# EasyEDA Pro project AudioPower.epro

# Schematic Schematic3
Board Name: Board3; Create Date: 2024-12-13; Page Name: P1; Project Name: kpi2024_0; Schematic Name: Schematic3; Update Date: 2024-12-13; Company: EasyEDA.com; Page Size: A4; Version: V1.0
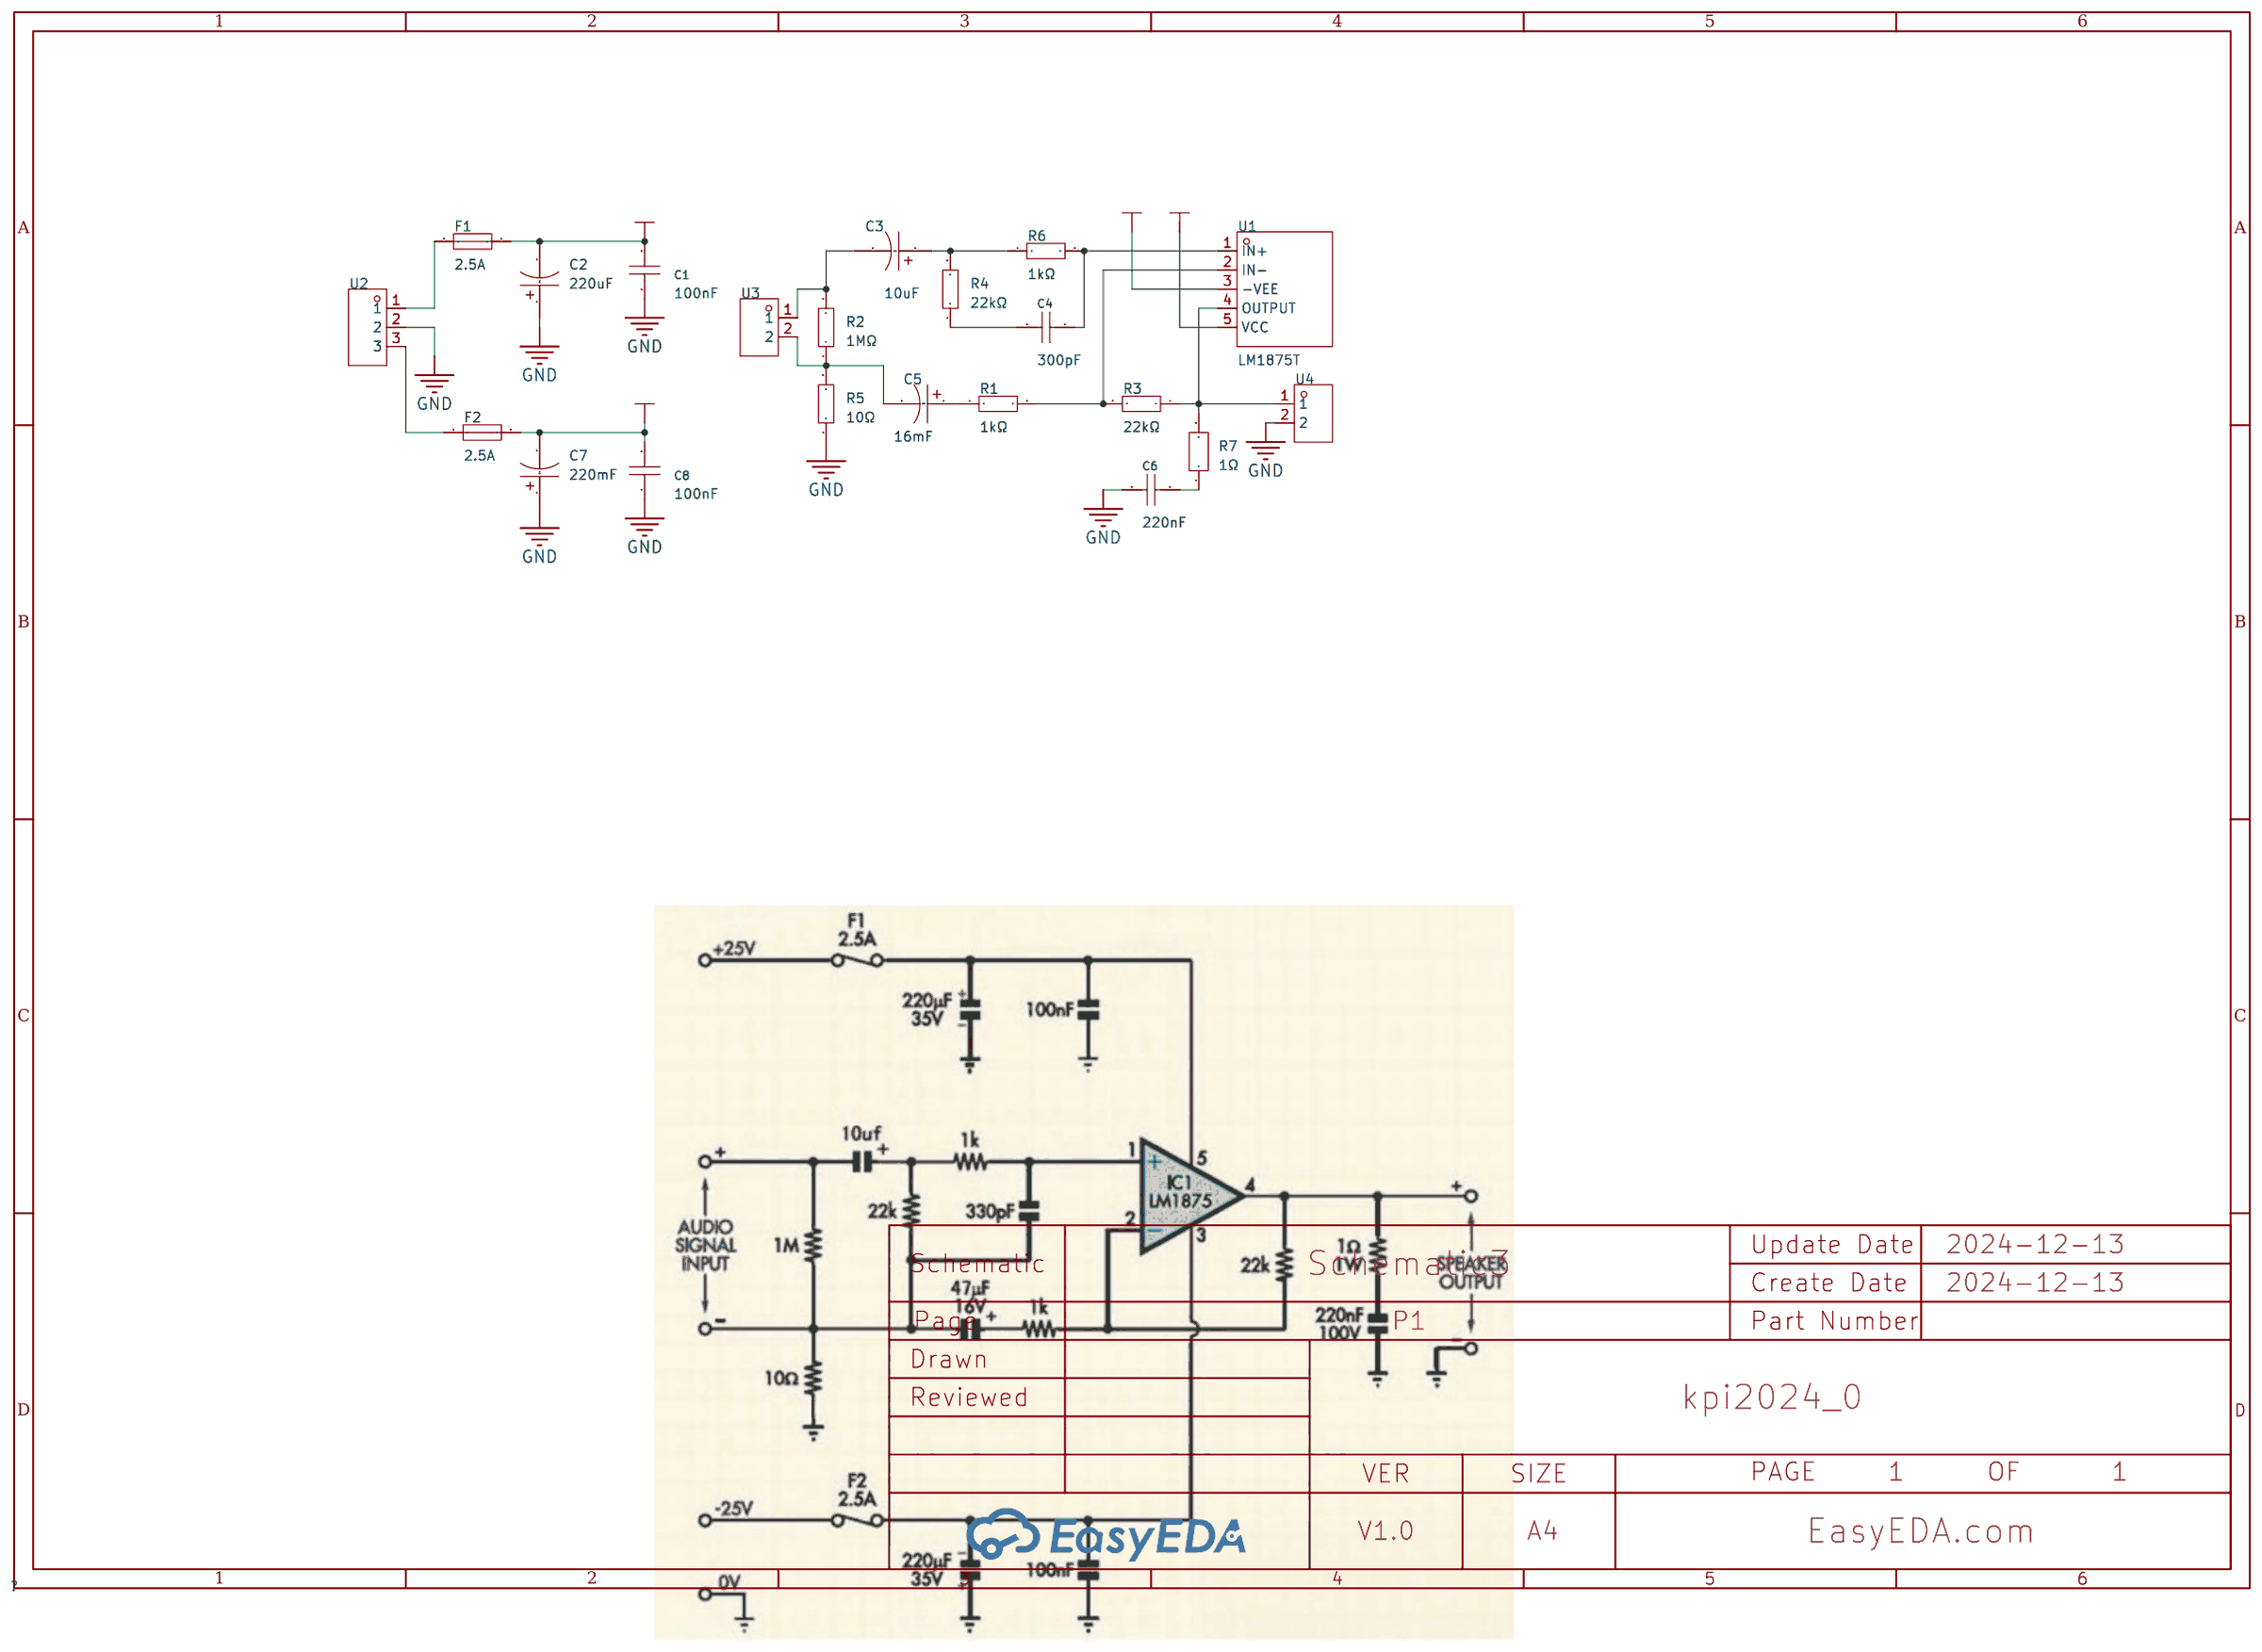
[diagram p0: schematic sheet]

## Parts
C1  100nF  [C0603]
C2  220uF  [CAP-SMD_L7.3-W4.3-FD]
C3  10uF  [CAP-SMD_L7.3-W4.3-FD]
C4  300pF  [C0603]
C5  16mF  [CAP-SMD_L7.3-W4.3-FD]
C6  220nF  [C0603]
C7  220mF  [CAP-SMD_L7.3-W4.3-FD]
C8  100nF  [C0603]
F1  2.5A  [F0603]
F2  2.5A  [F0603]
R1  1kΩ  [R0603]
R2  1МΩ  [R0603]
R3  22kΩ  [R0603]
R4  22kΩ  [R0603]
R5  10Ω  [R0603]
R6  1kΩ  [R0603]
R7  1Ω  [RES-TH_BD4.5-L11.0-P15.00-D0.7]
U1  LM1875T  [TO-220-5_L10.2-W4.8-P1.70-TL]
U2  DB910-6.35-3P-GN-P  [CONN-TH_3P-P6.35_DB910-6.35-3P-GN-P]
U3  TY500-5.0-02P-14-00AH  [CONN-TH_2P-P5.00_TOPONELEC_TY500-5.0-02P-14-00AH]
U4  TY500-5.0-02P-14-00AH  [CONN-TH_2P-P5.00_TOPONELEC_TY500-5.0-02P-14-00AH]

## Library data of the parts
C1 C4 C6 C8 = 0603B104K500NT_C30926: Capacitance:100nF Tolerance:±10% Tolerance:±10% Voltage Rated: Temperature Coefficient:; LCSC Part Name: 100nF ±10% 50V; Supplier Part: C30926; Manufacturer: FH(风华); Manufacturer Part: 0603B104K500NT; Supplier Footprint: 0603; JLCPCB Part Class: Extended Part; Datasheet: https://atta.szlcsc.com/upload/public/pdf/source/20200305/C486355_26A10D38EF8C2A5C37091D0039909270.pdf; Supplier: LCSC; Tolerance: ±10%
C2 C3 C5 C7 = 6TPF220MFL: Capacitance: Tolerance:±20% Tolerance:±20% Rated Voltage: Operating Temperature:-55℃~+105℃ Operating Temperature:-55℃~+105℃; LCSC Part Name: 220uF ±20% 6.3V; Supplier Part: C2972205; Manufacturer: PANASONIC(松下); JLCPCB Part Class: Extended Part; Datasheet: https://atta.szlcsc.com/upload/public/pdf/source/20220222/01A4DB965CB56D0C2F7295D2904BDB39.pdf; Supplier: LCSC; Tolerance: ±20%; Operating Temperature: -55℃~+105℃
F1 F2 = R06.000.2.5: Type:SMD Fuse Current Rating:2.5A; LCSC Part Name: 2.5A 63V; Supplier Part: C2874850; Manufacturer: Reomax(瑞迈); Supplier Footprint: 0603; JLCPCB Part Class: Extended Part; Datasheet: https://atta.szlcsc.com/upload/public/pdf/source/20210813/DD43B9BBE2E14D9CDA0B5C9047EE88A2.pdf; Supplier: LCSC; Type: SMD Fuse
R1-R6 = 0603WAF1001T5E: Type:Thick Film Resistors Resistance:1kΩ Tolerance:±1% Tolerance:±1% Power(Watts): Overload Voltage (Max): Temperature Coefficient:±100ppm/℃ Temperature Coefficient:±100ppm/℃ Operating Temperature Range:-55℃~+155℃ Operating Temperature Range:-55℃~+155℃; LCSC Part Name: 1kΩ ±1% 100mW 厚膜电阻; Supplier Part: C21190; Manufacturer: UNI-ROYAL(厚声); Supplier Footprint: 0603; JLCPCB Part Class: Basic Part; Datasheet: https://atta.szlcsc.com/upload/public/pdf/source/20200306/C422600_1E6D84923E4A46A82E41ADD87F860B5C.pdf; Supplier: LCSC; Type: Thick Film Resistors; Tolerance: ±1%; Temperature Coefficient: ±100ppm/℃; Operating Temperature Range: -55℃~+155℃
R7 = RN 1W 13R F T/B A1: Type:Metal Film Resistors Resistance: Tolerance:±1% Tolerance:±1% Overload Voltage (Max):500V Power(Watts):1W Temperature Coefficient:±50ppm/℃ Temperature Coefficient:±50ppm/℃ Operating Temperature Range:-55℃~+125℃ Operating Temperature Range:-55℃~+125℃; LCSC Part Name: 13Ω ±1% 1W 金属膜电阻; Supplier Part: C433630; Manufacturer: Tyohm(幸亚电阻); Supplier Footprint: 插件,D4.5xL11mm; JLCPCB Part Class: Extended Part; Datasheet: https://atta.szlcsc.com/upload/public/pdf/source/20191008/C433681_B72693A7FD256E0D1DC5EFE3F095EED3.pdf; Supplier: LCSC; Type: Metal Film Resistors; Tolerance: ±1%; Overload Voltage (Max): 500V; Power(Watts): 1W; Temperature Coefficient: ±50ppm/℃; Operating Temperature Range: -55℃~+125℃
U1 = LM1875T: Type of Power Amplifier: Speaker Channels:Monaural Output Power: Supply Voltage:16V~60V；8V~30V Supply Voltage:16V~60V；8V~30V Operating Temperature:0℃~+70℃ Operating Temperature:0℃~+70℃; Supplier Part: C2862102; Manufacturer: TI(德州仪器); Supplier Footprint: TO-220-5; JLCPCB Part Class: Extended Part; Datasheet: https://www.ti.com/cn/lit/gpn/lm1875; Supplier: LCSC; Speaker Channels: Monaural; Supply Voltage: 16V~60V；8V~30V; Operating Temperature: 0℃~+70℃
U2 = DB910-6.35-3P-GN-P: Structure:1x3P Pitch:6.35mm Color:Green Mounting Style:Straight Current Rating (Max):30A Voltage Rating (Max):300V Number of Pins:3P Number of Rows:1 Wire Gauge - AWG:10~26 Wire Gauge - AWG:10~26 Wire Gauge - mm2:1.5~4 Wire Gauge - mm2:1.5~4 Number of PIN; LCSC Part Name: 6.35mm 1x3P 排数:1 每排P数:3 直插; Supplier Part: C430611; Manufacturer: DORABO(地博电气); Supplier Footprint: 插件,P=6.35mm; JLCPCB Part Class: Extended Part; Datasheet: https://atta.szlcsc.com/upload/public/pdf/source/20230321/A80E2153EA7C3FC844CAA35FFFF2371B.pdf; Supplier: LCSC; Structure: 1x3P; Pitch: 6.35mm; Color: Green; Mounting Style: Straight; Current Rating (Max): 30A; Voltage Rating (Max): 300V; Number of Pins: 3P; Number of Rows: 1; Wire Gauge - AWG: 10~26; Wire Gauge - mm2: 1.5~4; Number of PINs Per Row: 3; Operating Temperature Range: -40℃~+105℃
U3 U4 = TY500-5.0-02P-14-00AH: Structure:1x2P Pitch:5mm Color:Green Mounting Style:Straight Current Rating (Max):20A Voltage Rating (Max):300V Number of Pins:2P Number of Rows:1 Wire Gauge - AWG:12~30 Wire Gauge - AWG:12~30 Wire Gauge - mm2:1~2.5 Wire Gauge - mm2:1~2.5 Number of PINs P; LCSC Part Name: 5mm 1x2P 排数:1 每排P数:2 直插; Supplier Part: C2840319; Manufacturer: Toponelec(拓宜); Supplier Footprint: 插件,P=5mm; JLCPCB Part Class: Extended Part; Datasheet: https://atta.szlcsc.com/upload/public/pdf/source/20210910/6CE4BD0E49897ED2865D72FFC2920D65.pdf; Supplier: LCSC; Structure: 1x2P; Pitch: 5mm; Color: Green; Mounting Style: Straight; Current Rating (Max): 20A; Voltage Rating (Max): 300V; Number of Pins: 2P; Number of Rows: 1; Wire Gauge - AWG: 12~30; Wire Gauge - mm2: 1~2.5; Number of PINs Per Row: 2; Operating Temperature Range: -40℃~+105℃

## Nets
+25V: C1.1 C2.2 F1.2 U1.5(VCC)
-25V: C7.2 C8.2 F2.2 U1.3(-VEE)
GND: C1.2 C2.1 C6.2 C7.1 C8.1 R5.1 U2.2 U4.2
Net-(C3-1): C3.1 R4.2 R6.1
Net-(C3-2): C3.2 R2.2 U3.1
Net-(C4-1): C4.1 R4.1
Net-(C4-2): C4.2 R6.2 U1.1(IN+)
Net-(C5-1): C5.1 R1.1
Net-(C5-2): C5.2 R2.1 R5.2 U3.2
Net-(C6-1): C6.1 R7.1
Net-(F1-1): F1.1 U2.1
Net-(F2-1): F2.1 U2.3
Net-(R1-2): R1.2 R3.2 U1.2(IN-)
Net-(R3-1): R3.1 R7.2 U1.4(OUTPUT) U4.1
